# EAGLE design Little-Wire.J+N (EAGLE 6.5.0)
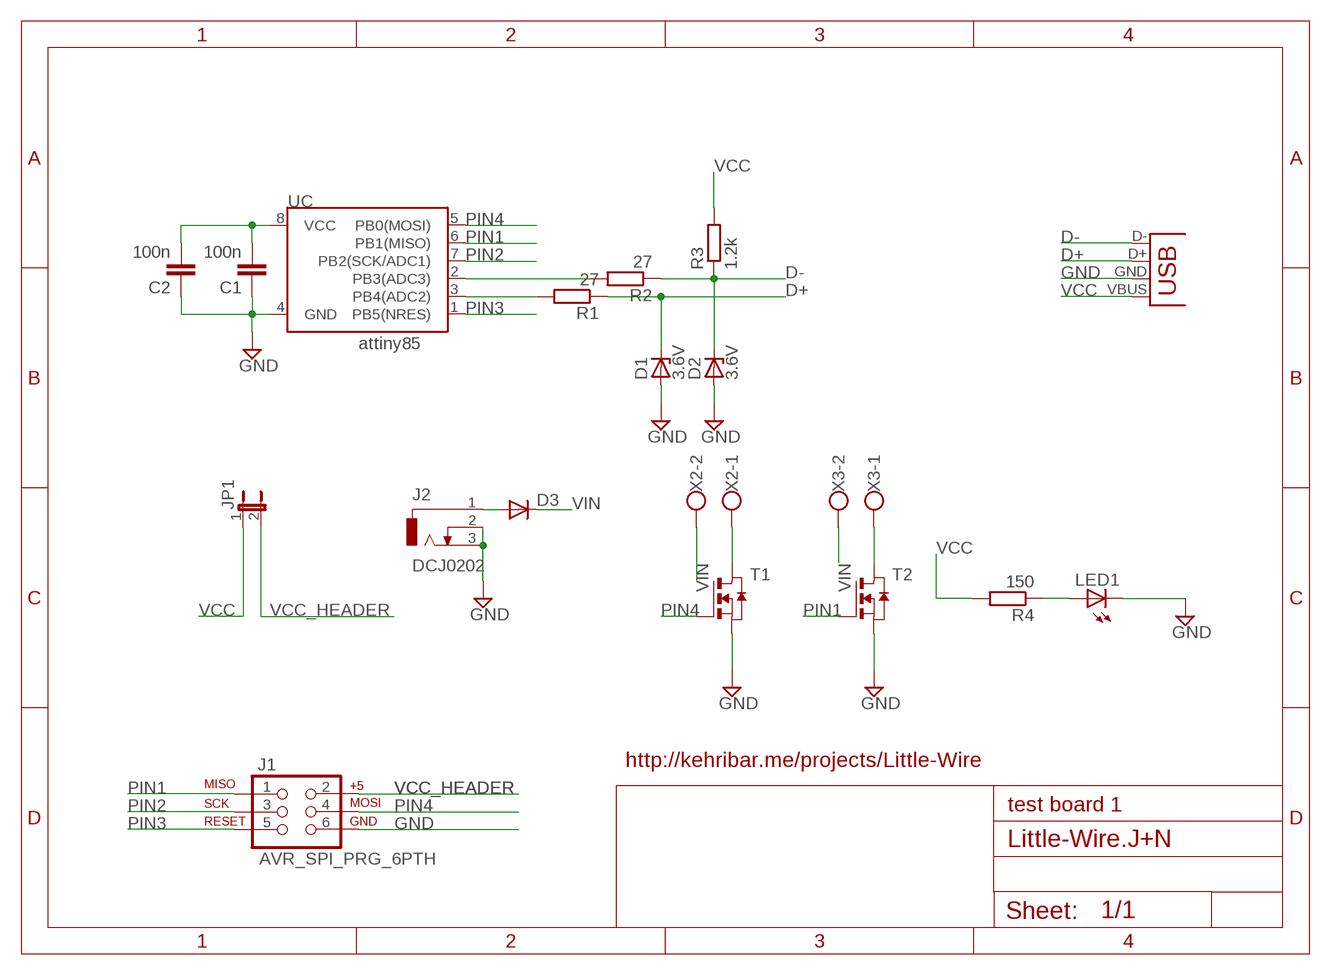
[diagram p0: schematic, sheet 1]

## Parts
C1  100n  C-EU050-025X075  [C050-025X075]
C2  100n  C-EU050-025X075  [C050-025X075]
D1  3.6V  ZENER-DIODEZD-5  [ZDIO-5]
D2  3.6V  ZENER-DIODEZD-5  [ZDIO-5]
D3  DIODE-D-7.5  [D-7.5]
J1  AVR_SPI_PRG_6PTH  [2X3]
J2  DCJ0202  [DCJ0202]
JP1  JUMPER-2PTH  [1X02]
LED1  LED3MM  [LED3MM]
R1  27  R-EU_0204/5  [0204/5]
R2  27  R-EU_0204/5  [0204/5]
R3  1.2k  R-EU_0204/5  [0204/5]
R4  150  R-EU_0204/5  [0204/5]
T1  NMOSSOT223  [SOT223]
T2  NMOSSOT223  [SOT223]
UC  ATTINY45DIP8  [DIP08]
X1  USB-A-H  [USB-A-H]
X2  W237-102  [W237-102]
X3  W237-102  [W237-102]

## Nets
D+: D1.C R1.1 X1.D+(D-)
D-: D2.C R2.1 R3.1 X1.D-(D+)
EXT1: T1.2(D) T1.4(D) X2.1
EXT2: T2.2(D) T2.4(D) X3.1
GND: C1.1 C2.1 D1.A D2.A J1.6 J2.2 J2.3 LED1.K(C) T1.3(S) T2.3(S) UC.4(GND) X1.GND(VBUS)
N$1: R2.2 UC.2(PB3(ADC3))
N$2: R1.2 UC.3(PB4(ADC2))
N$3: LED1.A R4.1
N$4: D3.A J2.1
PIN1: J1.1 T2.1(G) UC.6(PB1(MISO))
PIN2: J1.3 UC.7(PB2(SCK/ADC1))
PIN3: J1.5 UC.1(PB5(NRES))
PIN4: J1.4 T1.1(G) UC.5(PB0(MOSI))
VCC: C1.2 C2.2 JP1.1 R3.2 R4.2 UC.8(VCC) X1.VBUS(GND)
VCC_HEADER: J1.2 JP1.2
VIN: D3.C X2.2 X3.2

## Notes on the sheet
- attiny85
- http://kehribar.me/projects/Little-Wire
- test board 1

## Library data of the parts
C1 C2 = rcl:C-EU: CAPACITOR, European symbol
D1 D2 = diode:ZENER-DIODE: Z-Diode
D3 = diode:DIODE-: DIODE
J1 = SparkFun:AVR_SPI_PRG_6: AVR ISP 6 Pin This is the reduced ISP connector for AVR programming. Common on Arduino. This footprint will take up less PCB space and can be used with a 10-pin to 6-pin adapter such as SKU: BOB-08508
J2 = con-jack:DCJ0202: DC POWER JACK Source: DCJ0202.pdf; OC_FARNELL: unknown; OC_NEWARK: unknown
JP1 = SparkFun:JUMPER-2: Jumper Basic 0.1" spaced jumper. Use with breakaway headers.
LED1 = led:LED: LED OSRAM: - CHIPLED LG R971, LG N971, LY N971, LG Q971, LY Q971, LO R971, LY R971 LH N974, LH R974 LS Q976, LO Q976, LY Q976 LO Q996 - Hyper CHIPLED LW Q18S LB Q993, LB Q99A, LB R99A - SideLED LS A670, LO A670, LY A670, LG A670, LP A670 LB A673, LV A673, LT A673, LW A673 LH A674 LY A675 LS A676, LA A676, LO A676, LY A676, LW A676 LS A679, LY A679, LG A679 - Hyper Micro SIDELED® LS Y876, LA Y876, LO Y876, LY Y876 LT Y87S - SmartLED LW L88C, LW L88S LB L89C, LB L89S, LG L890 LS L89K, LO L89K, LY L89K LS L896, LA L896, LO L896, LY L896 - TOPLED LS T670, LO T670, LY T670, LG T670, LP T670 LSG T670, LSP T670, LSY T670, LOP T670, LYG T670 LG T671, LOG T671, LSG T671 LB T673, LV T673, LT T673, LW T673 LH T674 LS T676, LA T676, LO T676, LY T676, LB T676, LH T676, LSB T676, LW T676 LB T67C, LV T67C, LT T67C, LS T67K, LO T67K, LY T67K, LW E67C LS E67B, LA E67B, LO E67B, LY E67B, LB E67C, LV E67C, LT E67C LW T67C LS T679, LY T679, LG T679 LS T770, LO T770, LY T770, LG T770, LP T770 LB T773, LV T773, LT T773, LW T773 LH T774 LS E675, LA E675, LY E675, LS T675 LS T776, LA T776, LO T776, LY T776, LB T776 LHGB T686 LT T68C, LB T68C - Hyper Mini TOPLED® LB M676 - Mini TOPLED Santana® LG M470 LS M47K, LO M47K, LY M47K Source: http://www.osram.convergy.de LUXEON: - LUMILED® LXK2-PW12-R00, LXK2-PW12-S00, LXK2-PW14-U00, LXK2-PW14-V00 LXK2-PM12-R00, LXK2-PM12-S00, LXK2-PM14-U00 LXK2-PE12-Q00, LXK2-PE12-R00, LXK2-PE12-S00, LXK2-PE14-T00, LXK2-PE14-U00 LXK2-PB12-K00, LXK2-PB12-L00, LXK2-PB12-M00, LXK2-PB14-N00, LXK2-PB14-P00, LXK2-PB14-Q00 LXK2-PR12-L00, LXK2-PR12-M00, LXK2-PR14-Q00, LXK2-PR14-R00 LXK2-PD12-Q00, LXK2-PD12-R00, LXK2-PD12-S00 LXK2-PH12-R00, LXK2-PH12-S00 LXK2-PL12-P00, LXK2-PL12-Q00, LXK2-PL12-R00 Source: www.luxeon.com KINGBRIGHT: KA-3528ASYC Source: www.kingbright.com
R1-R4 = rcl:R-EU_: RESISTOR, European symbol
T1 T2 = zetex:NMOSSOT223: MOS FET; OC_FARNELL: unknown; OC_NEWARK: unknown
UC = SparkFun:ATTINY45: Atmel ATTiny45
X1 = SparkFun:USB: USB Connectors USB-B-PTH is fully proven SKU : PRT-00139 USB-miniB is fully proven SKU : PRT-00587 USB-A-PCB is untested. USB-A-H is throughly reviewed, but untested. Spark Fun Electronics SKU : PRT-00437 USB-B-SMT is throughly reviewed, but untested. Needs silkscreen touching up. USB-A-S has not been used/tested USB-MB-H has not been used/tested
X2 X3 = con-wago-500:W237-102: WAGO SCREW CLAMP; MPN: 237-102; OC_FARNELL: unknown; OC_NEWARK: 70K9898

## Board
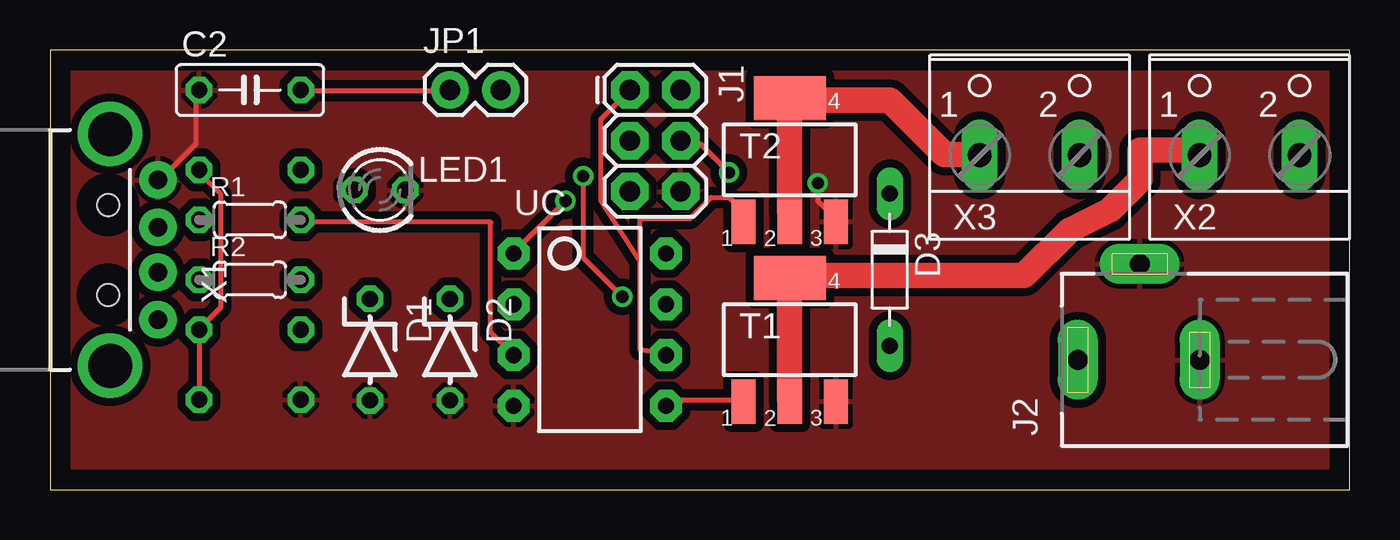
[diagram p1: board, top side]
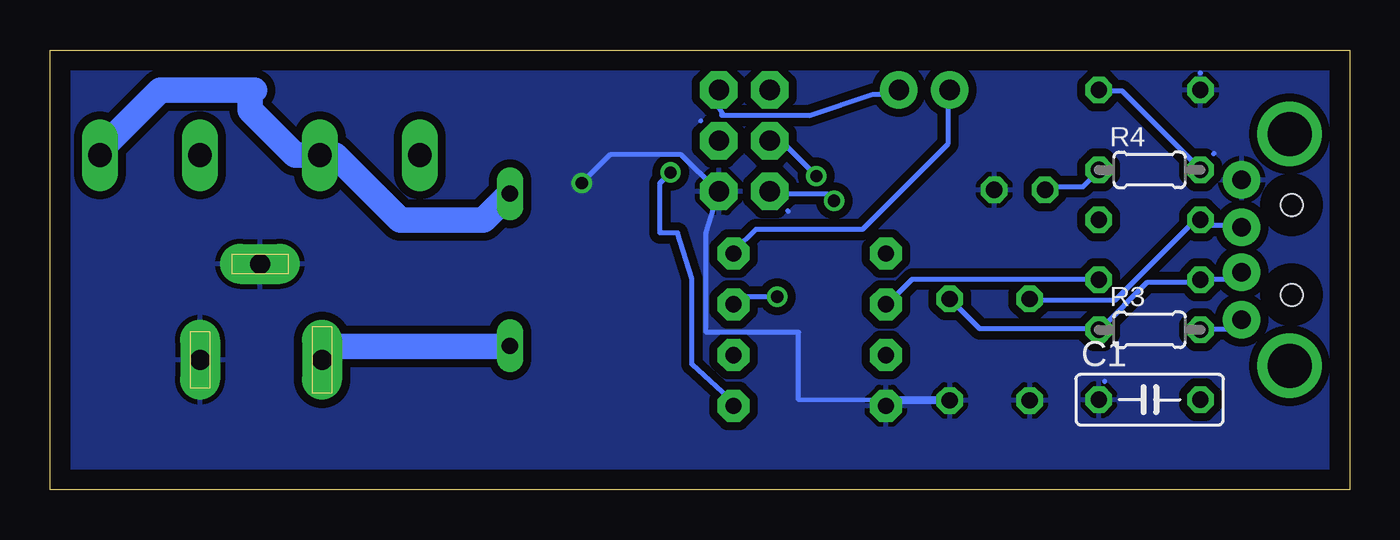
[diagram p2: board, bottom side, seen from below]

Size 65 x 22 mm. Coordinates in mm from the lower left corner, seen from the top.
Outline: 0,0 65,0 65,22 0,22 0,0
Copper layers (1*16): Top 0.035mm / dielectric 1.5mm / Bottom 0.035mm
Design rules "default": minimum track width 10mil, minimum drill 24mil, track to track 8mil, track to pad 8mil, pad to pad 8mil, via to via 8mil, smd to smd 8mil, copper to edge 40mil, drill to drill 8mil, minimum pad ring 10mil, minimum via ring 8mil, stop-mask expansion 4mil, vias tented up to drill 0mil, thermal gap 10mil

### Footprints (pad centres in the part's own frame; a part is rotated, then mirrored left to right if it is on the bottom)
C050-025X075 = drill 0.813 octagon: 1 -2.54,0; 2 2.54,0
ZDIO-5 = drill 0.813 octagon: A 2.54,0; C -2.54,0
D-7.5 = drill 0.813 long: A 3.81,0; C -3.81,0
2X3 = drill 1.016 pad 1.88 octagon: 1 0,0; 2 0,2.54; 3 2.54,0; 4 2.54,2.54; 5 5.08,0; 6 5.08,2.54
DCJ0202 = drill 1 pad 2 long: 1 0,3.1; 2 4.8,0; 3 0,-3
1X02 = drill 1.016 pad 1.88: 1 0,0; 2 2.54,0
LED3MM = drill 0.813 octagon: A -1.27,0; K 1.27,0
0204/5 = drill 0.813 octagon: 1 -2.54,0; 2 2.54,0
SOT223 = smd 1.219 x 2.235: 1 -2.311,-3.099; 2 0,-3.099; 3 2.311,-3.099 | smd 3.6 x 2.2: 4 0,3.099
DIP08 = drill 0.813 pad 1.6 octagon: 1 -3.81,-3.81; 2 -1.27,-3.81; 3 1.27,-3.81; 4 3.81,-3.81; 5 3.81,3.81; 6 1.27,3.81; 7 -1.27,3.81; 8 -3.81,3.81
USB-A-H = drill 0.914 pad 1.88: D+ 2.4,1.127; D- 2.4,-1.127; GND 2.4,3.5; VBUS 2.4,-3.5 | drill 2.2: GND2 0,-5.8; GND3 0,5.8 | hole 1.1: -0.1,2.25; -0.1,-2.25
W237-102 = drill 1.194 long: 1 -2.5,-1.27; 2 2.5,-1.27

### Placement (x,y rotation side)
C1  10,4.5 0 bottom
C2  10,20 0 top
D1  16,7 270 top
D2  20,7 270 top
D3  42,11 270 top
J1  29,20 270 top
J2  54.5,6.5 90 top
JP1  20,20 0 top
LED1  16.5,15 0 top
R1  10,13.5 0 top
R2  10,10.5 0 top
R3  10,8 0 bottom
R4  10,16 0 bottom
T1  37,7.5 0 top
T2  37,16.5 0 top
UC  27,8 270 top
X1  3,12 0 top
X2  60,18 0 top
X3  49,18 0 top

### Tracks (layer width: path | path; a pad name or v marks a point on that pad's centre or on a via)
D+
  Bottom 0.254: X1.D+ 5.51,13.2 7.11,13.2 7.29,13.38 R1.1 7.47,13.38 7.82,13.38 11.73,9.47 15.82,9.47 D1.C
D-
  Bottom 0.254: D2.C 19.91,9.47 18.49,8.04 12.62,8.04 R3.1 12.45,8.04 10.13,10.36 7.47,10.36 R2.1 7.29,10.53 5.69,10.53 5.51,10.71 X1.D-
EXT1
  Top 0.254: 36.98,4.49 T1.2 | 36.98,10.53 T1.4 37.16,10.71 | 57.43,16.76 X2.1
  Top 1.27: 36.98,10.53 36.98,4.49 | 37.16,10.71 48.71,10.71 51,13 53,14 54.5,15.5 54.5,17 57.23,17 X2.1
EXT2
  Top 0.254: 36.98,13.91 T2.2 | 36.98,19.96 T2.4 37.16,19.96 38.58,19.96 | 46.41,16.76 X3.1
  Top 1.27: 36.98,19.96 arc-1 36.98,13.91 | 46.41,16.76 44.74,16.76 42,19.5 37.1,19.5 T2.4
GND  (via drill 0.61)
  Top 0.254: X1.GND 5.51,15.51 7.29,17.29 7.29,19.96 C2.1 | v38.41,15.34 38.41,14.45 39.29,13.56 T2.3
  Bottom 0.254: 23.19,4.46 27.56,4.49 27.56,7.87 32.18,7.87 32.18,12.85 J1.6 31.65,14.98 33.43,16.76 36.98,16.76 v38.41,15.34 | 7.47,20.85 7.46,20.85 | 6.8,16.8 6.78,16.82 | 32.45,18.45 | 28.1,13.95 28.08,13.93 | 17.75,15 LED1.K | 12.25,5.4 12.25,5.41 | 55.7,11.3 J2.2
  Bottom 0.406: D2.A 23.19,4.46 UC.4
  pour Top (isolate 0.406): 0,22 65,22 65,0 0,0
  pour Bottom (isolate 0.406): 0,22 65,22 65,0 0,0
N$1
  Bottom 0.254: R2.2 12.62,10.53 21.87,10.53 23.11,9.29 UC.2
N$2
  Top 0.254: R1.2 12.62,13.38 22.05,13.38 22.05,7.87 23.11,6.8 UC.3
N$3
  Bottom 0.254: R4.1 12.62,15.87 13.34,15.16 15.11,15.16 LED1.A
N$4
  Bottom 0.254: D3.A 41.96,7.16 42.14,7.16
  Bottom 1.27: 42.14,7.16 50.74,7.16 J2.1
PIN1
  Top 0.254: 29.52,11.42 29.52,6.98 30.76,6.8 UC.6 | 29.52,11.42 29.52,13.56 32,13.56 33.07,14.62 33.96,14.62 34.67,13.91 T2.1 | 29.52,11.42 27.56,14.45 27.56,18.54 28.98,19.96 J1.1
PIN2  (via drill 0.61)
  Top 0.254: v28.63,9.64 26.67,11.6 v26.67,15.69
  Bottom 0.254: v28.63,9.64 30.4,9.64 30.76,9.29 UC.7 | v26.67,15.69 28.27,17.29 28.98,17.29 J1.3
PIN3  (via drill 0.61)
  Top 0.254: v25.78,14.45 23.29,11.96 UC.1
  Bottom 0.254: v25.78,14.45 26.14,14.8 28.98,14.8 J1.5
PIN4  (via drill 0.61)
  Top 0.254: T1.1 34.67,4.49 31.65,4.49 31.47,4.31 30.94,4.31 UC.5 | v33.96,15.87 32.54,17.29 31.65,17.29 J1.4
  Bottom 0.254: v33.96,15.87 34.49,15.34 34.49,12.85 33.6,12.85 32.89,10.53 32.89,6.27 30.76,4.31 UC.5
VCC
  Top 0.254: C1.2 7.47,4.67 7.47,7.87 R3.2 7.47,8.04 8.53,9.11 8.53,14.8 7.47,15.87 R4.2 | JP1.1 19.91,19.96 12.62,19.96 C2.2
  Bottom 0.254: UC.8 30.76,11.96 29.69,13.02 24.36,13.02 20.09,17.29 20.09,19.96 JP1.1 | X1.VBUS 5.51,8.4 5.87,8.04 7.29,8.04 R3.2 | R4.2 7.47,16.05 11.38,19.96 12.45,19.96 C2.2
VCC_HEADER
  Bottom 0.254: 31.4,18.87 31.65,19.25 31.65,19.96 J1.2 | 31.4,18.87 31.29,18.71 | JP1.2 22.58,19.96 22.94,19.78 23.82,19.78 27.03,18.71 31.4,18.71 31.4,18.87
VIN
  Bottom 1.27: D3.C 43.31,13.5 47.5,13.5 50.73,16.73 X3.2 52.73,16.73 55,19 55,20 | 54.77,20 55,20 | 55,20 59.5,20 62.5,17 X2.2